# EAGLE design KramerMC_BS1k_ferryTALE2022_v1.0 (EAGLE 6.6.0)

## Sheet 1 of 2: BWS
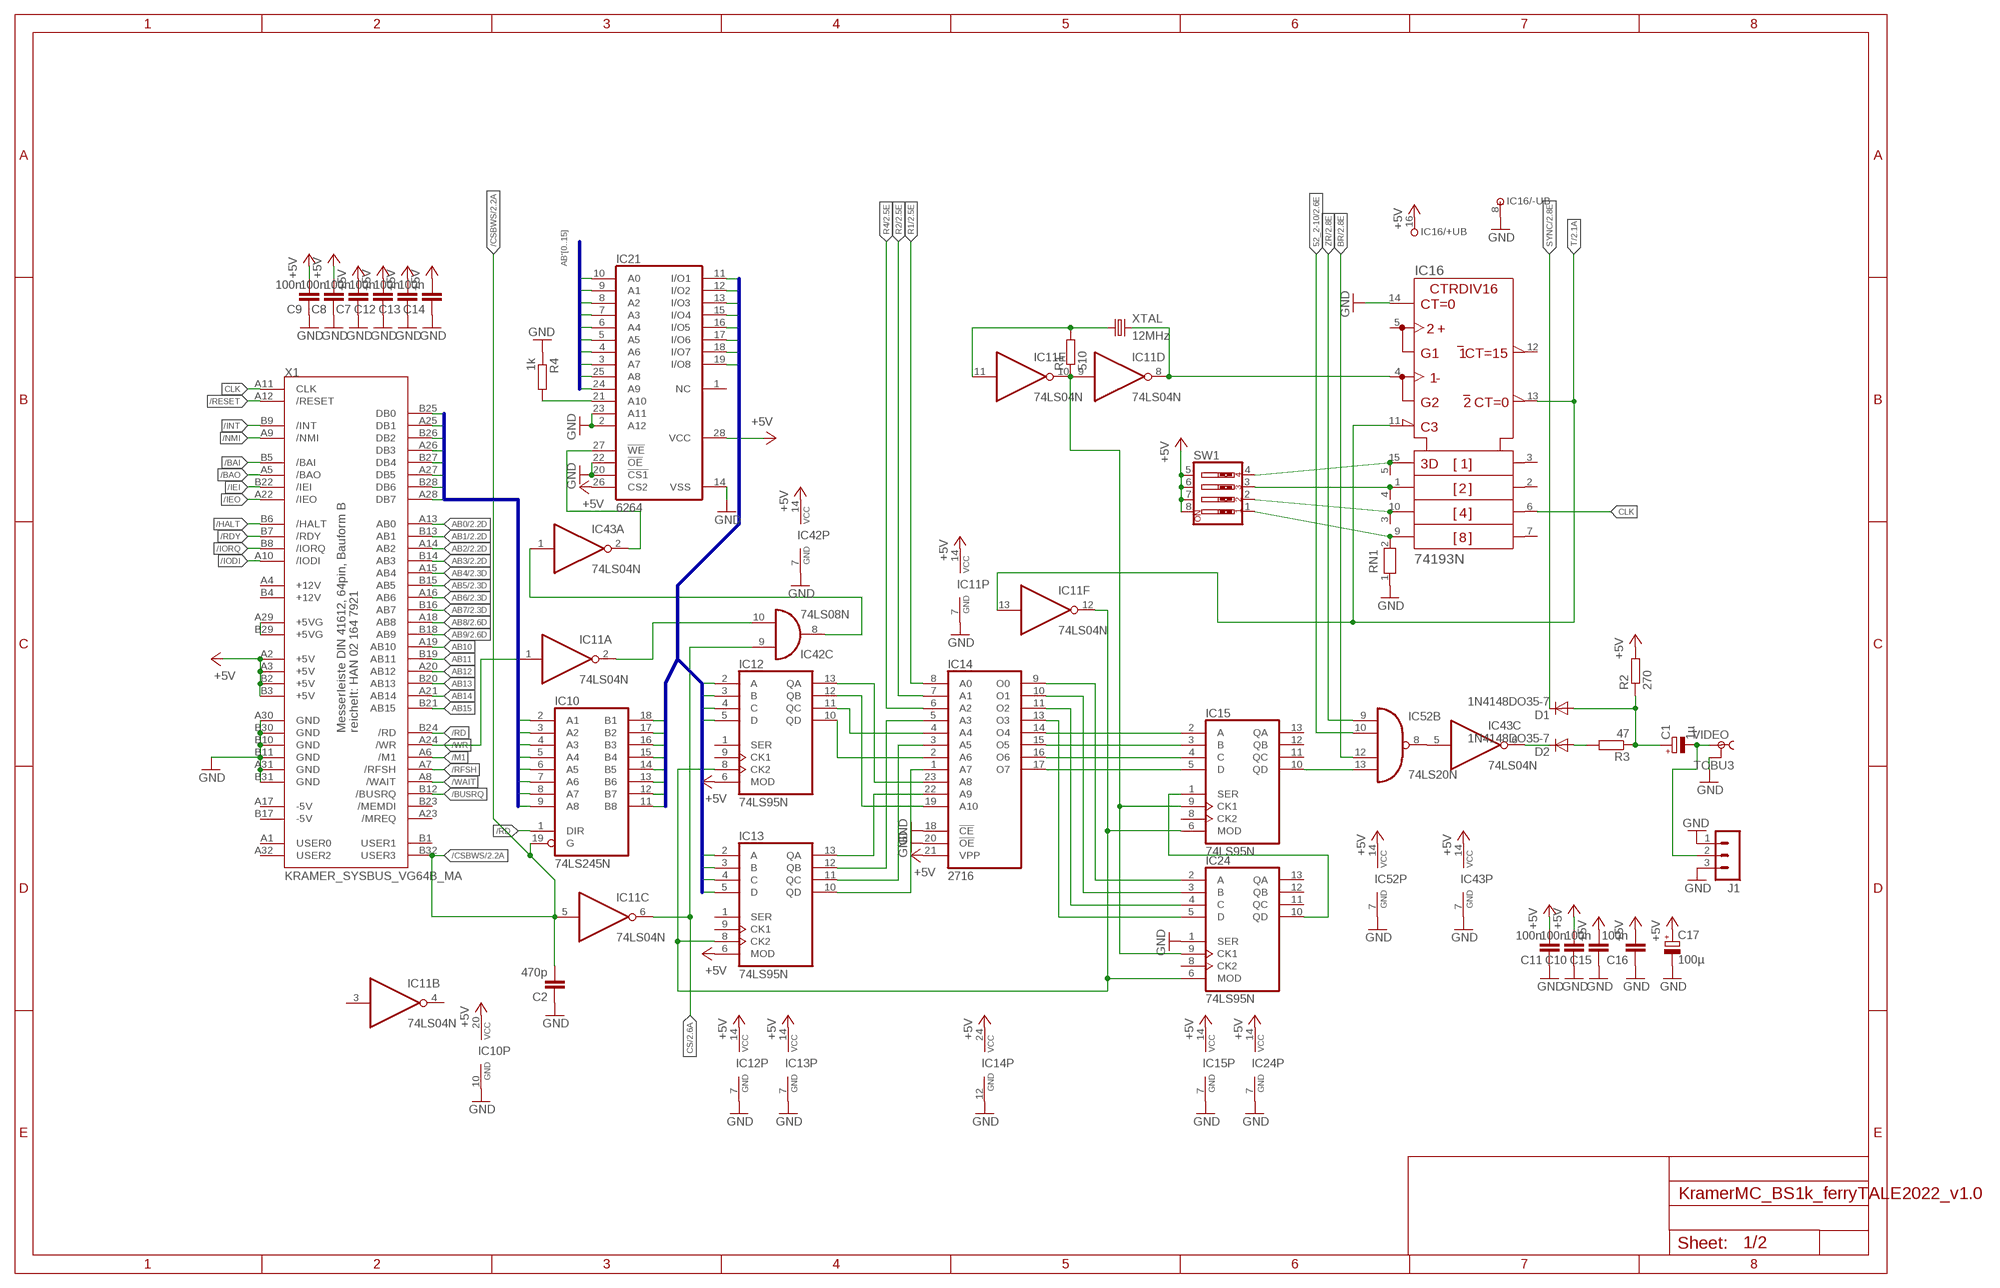
[diagram p0: schematic, sheet 1]

### Parts
C1  1µ  CPOL-EUE2.5-5  [E2,5-5]
C2  470p  C-EU050-024X044  [C050-024X044]
C7  100n  C-EU050-024X044  [C050-024X044]
C8  100n  C-EU050-024X044  [C050-024X044]
C9  100n  C-EU050-024X044  [C050-024X044]
C10  100n  C-EU050-024X044  [C050-024X044]
C11  100n  C-EU050-024X044  [C050-024X044]
C12  100n  C-EU050-024X044  [C050-024X044]
C13  100n  C-EU050-024X044  [C050-024X044]
C14  100n  C-EU050-024X044  [C050-024X044]
C15  100n  C-EU050-024X044  [C050-024X044]
C16  100n  C-EU050-024X044  [C050-024X044]
C17  100µ  CPOL-EUE2.5-7  [E2,5-7]
D1  1N4148DO35-7  [DO35-7]
D2  1N4148DO35-7  [DO35-7]
IC10  74LS245N  [DIL20]
IC11  74LS04N  [DIL14]
IC12  74LS95N  [DIL14]
IC13  74LS95N  [DIL14]
IC14  2716  [DIL24]
IC15  74LS95N  [DIL14]
IC16  74193N  [DIL16]
IC21  6264  6264A  [DIL28-6]
IC24  74LS95N  [DIL14]
IC42  74LS08N  [DIL14]
IC43  74LS04N  [DIL14]
IC52  74LS20N  [DIL14]
J1  MA03-1  [MA03-1]
R1  510  R-EU_0207/2V  [0207/2V]
R2  270  R-EU_0207/10  [0207/10]
R3  47  R-EU_0207/10  [0207/10]
R4  1k  R-EU_0207/10  [0207/10]
RN1  RN04  [RN-5]
SW1  SW_DIP-4  [EDG-04]
VIDEO  TOBU3  [TOBU3]
X1  KRAMER_SYSBUS_VG64B_MA  [MAB64]
XTAL  12MHz  CRYSTALHC49S  [HC49/S]

### Nets
52_2-10: IC52.10(B:I1) ; also sheet 2
+5V: C7.2 C8.2 C9.2 C10.2 C11.2 C12.2 C13.2 C14.2 C15.2 C16.2 C17.+ IC10.20(VCC) IC11.14(P:VCC) IC12.6(MOD) IC12.14(VCC) IC13.6(MOD) IC13.14(VCC) IC14.21(VPP) IC14.24(VCC) IC15.14(VCC) IC16.16(+UB) IC21.26(CS2) IC21.28(VCC) IC24.14(VCC) IC42.14(P:VCC) IC43.14(P:VCC) IC52.14(P:VCC) R2.2 SW1.5 SW1.6 SW1.7 SW1.8 X1.A2(+5V) X1.A3(+5V) X1.B2(+5V) X1.B3(+5V) ; also sheet 2
+5VG: X1.A29(+5VG) X1.B29(+5VG)
/BAI: X1.B5(/BAI)
/BAO: X1.A5(/BAO)
/BUSRQ: X1.B12(/BUSRQ)
/CSBWS: C2.2 IC10.19(G) IC11.5(C:I) X1.B32(USER3) ; also sheet 2
/HALT: X1.B6(/HALT)
/IEI: X1.B22(/IEI)
/IEO: X1.A22(/IEO)
/INT: X1.B9(/INT)
/IODI: X1.A10(/IODI)
/IORQ: X1.B8(/IORQ)
/M1: X1.A6(/M1)
/NMI: X1.A9(/NMI)
/RD: IC10.1(DIR) X1.B24(/RD)
/RDY: X1.B7(/RDY)
/RESET: X1.A12(/RESET)
/RFSH: X1.A7(/RFSH)
/WAIT: X1.A8(/WAIT)
/WR: IC11.1(A:I) X1.A24(/WR)
AB0: X1.A13(AB0) ; also sheet 2
AB1: X1.B13(AB1) ; also sheet 2
AB2: X1.A14(AB2) ; also sheet 2
AB3: X1.B14(AB3) ; also sheet 2
AB4: X1.A15(AB4) ; also sheet 2
AB5: X1.B15(AB5) ; also sheet 2
AB6: X1.A16(AB6) ; also sheet 2
AB7: X1.B16(AB7) ; also sheet 2
AB8: X1.A18(AB8) ; also sheet 2
AB9: X1.B18(AB9) ; also sheet 2
AB10: X1.A19(AB10)
AB11: X1.B19(AB11)
AB12: X1.A20(AB12)
AB13: X1.B20(AB13)
AB14: X1.A21(AB14)
AB15: X1.B21(AB15)
AB'0: IC21.10(A0) ; also sheet 2
AB'1: IC21.9(A1) ; also sheet 2
AB'2: IC21.8(A2) ; also sheet 2
AB'3: IC21.7(A3) ; also sheet 2
AB'4: IC21.6(A4) ; also sheet 2
AB'5: IC21.5(A5) ; also sheet 2
AB'6: IC21.4(A6) ; also sheet 2
AB'7: IC21.3(A7) ; also sheet 2
AB'8: IC21.25(A8) ; also sheet 2
AB'9: IC21.24(A9) ; also sheet 2
BR: IC52.12(B:I2) ; also sheet 2
CLK: IC16.6(QC) X1.A11(CLK)
CS: IC11.6(C:O) IC42.9(C:I0) ; also sheet 2
DB0: IC10.9(A8) X1.B25(DB0)
DB1: IC10.8(A7) X1.A25(DB1)
DB2: IC10.7(A6) X1.B26(DB2)
DB3: IC10.6(A5) X1.A26(DB3)
DB4: IC10.5(A4) X1.B27(DB4)
DB5: IC10.4(A3) X1.A27(DB5)
DB6: IC10.3(A2) X1.B28(DB6)
DB7: IC10.2(A1) X1.A28(DB7)
DB'0: IC10.11(B8) IC13.3(B) IC21.11(I/O1)
DB'1: IC10.12(B7) IC12.4(C) IC21.12(I/O2)
DB'2: IC10.13(B6) IC13.4(C) IC21.13(I/O3)
DB'3: IC10.14(B5) IC12.5(D) IC21.15(I/O4)
DB'4: IC10.15(B4) IC13.5(D) IC21.16(I/O5)
DB'5: IC10.16(B3) IC12.2(A) IC21.17(I/O6)
DB'6: IC10.17(B2) IC13.2(A) IC21.18(I/O7)
DB'7: IC10.18(B1) IC12.3(B) IC21.19(I/O8)
GND: C2.1 C7.1 C8.1 C9.1 C10.1 C11.1 C12.1 C13.1 C14.1 C15.1 C16.1 C17.- IC10.10(GND) IC11.7(P:GND) IC12.7(GND) IC13.7(GND) IC14.12(GND) IC14.18(!CE) IC14.20(!OE) IC15.7(GND) IC16.8(-UB) IC16.14(CLR) IC21.2(A12) IC21.14(VSS) IC21.20(!CS1) IC21.22(!OE) IC21.23(A11) IC24.1(SER) IC24.7(GND) IC42.7(P:GND) IC43.7(P:GND) IC52.7(P:GND) J1.1 J1.3 R4.1 RN1.1 VIDEO.2 VIDEO.2@1 VIDEO.2@2 X1.A30(GND) X1.A31(GND) X1.B10(GND) X1.B11(GND) X1.B30(GND) X1.B31(GND) ; also sheet 2
N$1: IC11.9(D:I) IC11.10(E:O) IC15.9(CK1) IC24.9(CK1) R1.1
N$2: IC11.11(E:I) R1.2 XTAL.1
N$3: IC11.8(D:O) IC16.4(DOWN) XTAL.2
N$4: IC12.13(QA) IC14.23(A8)
N$5: IC12.12(QB) IC14.19(A10)
N$6: IC12.11(QC) IC14.4(A4)
N$7: IC12.10(QD) IC14.2(A6)
N$8: IC13.13(QA) IC14.22(A9)
N$9: IC13.12(QB) IC14.5(A3)
N$10: IC13.11(QC) IC14.3(A5)
N$11: IC13.10(QD) IC14.1(A7)
N$12: IC14.17(O7) IC15.5(D)
N$13: IC11.2(A:O) IC42.10(C:I1)
N$14: IC42.8(C:O) IC43.1(A:I)
N$15: IC21.27(!WE) IC43.2(A:O)
N$16: IC14.16(O6) IC15.4(C)
N$17: IC14.15(O5) IC15.3(B)
N$18: C1.- J1.2 VIDEO.1
N$19: IC14.14(O4) IC15.2(A)
N$20: IC43.5(C:I) IC52.8(B:O)
N$21: IC14.13(O3) IC24.5(D)
N$22: IC14.11(O2) IC24.4(C)
N$23: IC14.10(O1) IC24.3(B)
N$24: IC14.9(O0) IC24.2(A)
N$25: IC15.1(SER) IC24.10(QD)
N$27: IC11.12(F:O) IC12.8(CK2) IC13.8(CK2) IC15.6(MOD) IC24.6(MOD)
N$28: C1.+ D1.A R2.1 R3.1
N$29: IC15.10(QD) IC52.13(B:I3)
N$30: IC16.15(A) RN1.5 SW1.4
N$31: D2.A R3.2
N$32: D2.C IC43.6(C:O)
N$50: IC16.1(B) RN1.4 SW1.3
N$58: IC16.10(C) RN1.3 SW1.2
N$59: IC16.9(D) RN1.2 SW1.1
N$60: IC21.21(A10) R4.2
R1: IC14.8(A0) ; also sheet 2
R2: IC14.7(A1) ; also sheet 2
R4: IC14.6(A2) ; also sheet 2
SYNC: D1.C ; also sheet 2
T: IC11.13(F:I) IC16.11(!LOAD) IC16.13(!BO) ; also sheet 2
ZR: IC52.9(B:I0) ; also sheet 2
Unconnected: IC11.3(B:I) IC11.4(B:O) IC12.1(SER) IC12.9(CK1) IC13.1(SER) IC13.9(CK1) IC15.8(CK2) IC15.11(QC) IC15.12(QB) IC15.13(QA) IC16.2(QB) IC16.3(QA) IC16.5(UP) IC16.7(QD) IC16.12(!CO) IC21.1(NC) IC24.8(CK2) IC24.11(QC) IC24.12(QB) IC24.13(QA) X1.A1(USER0) X1.A4(+12V) X1.A17(-5V) X1.A23(/MREQ) X1.A32(USER2) X1.B1(USER1) X1.B4(+12V) X1.B17(-5V) X1.B23(/MEMDI)

### Buses
DB[0..7]
DB'[0..7]
AB'[0..15]

### Notes on the sheet
- Messerleiste DIN 41612, 64pin, Bauform B
  reichelt: HAN 02 164 7921

## Sheet 2 of 2: Zeitbasis
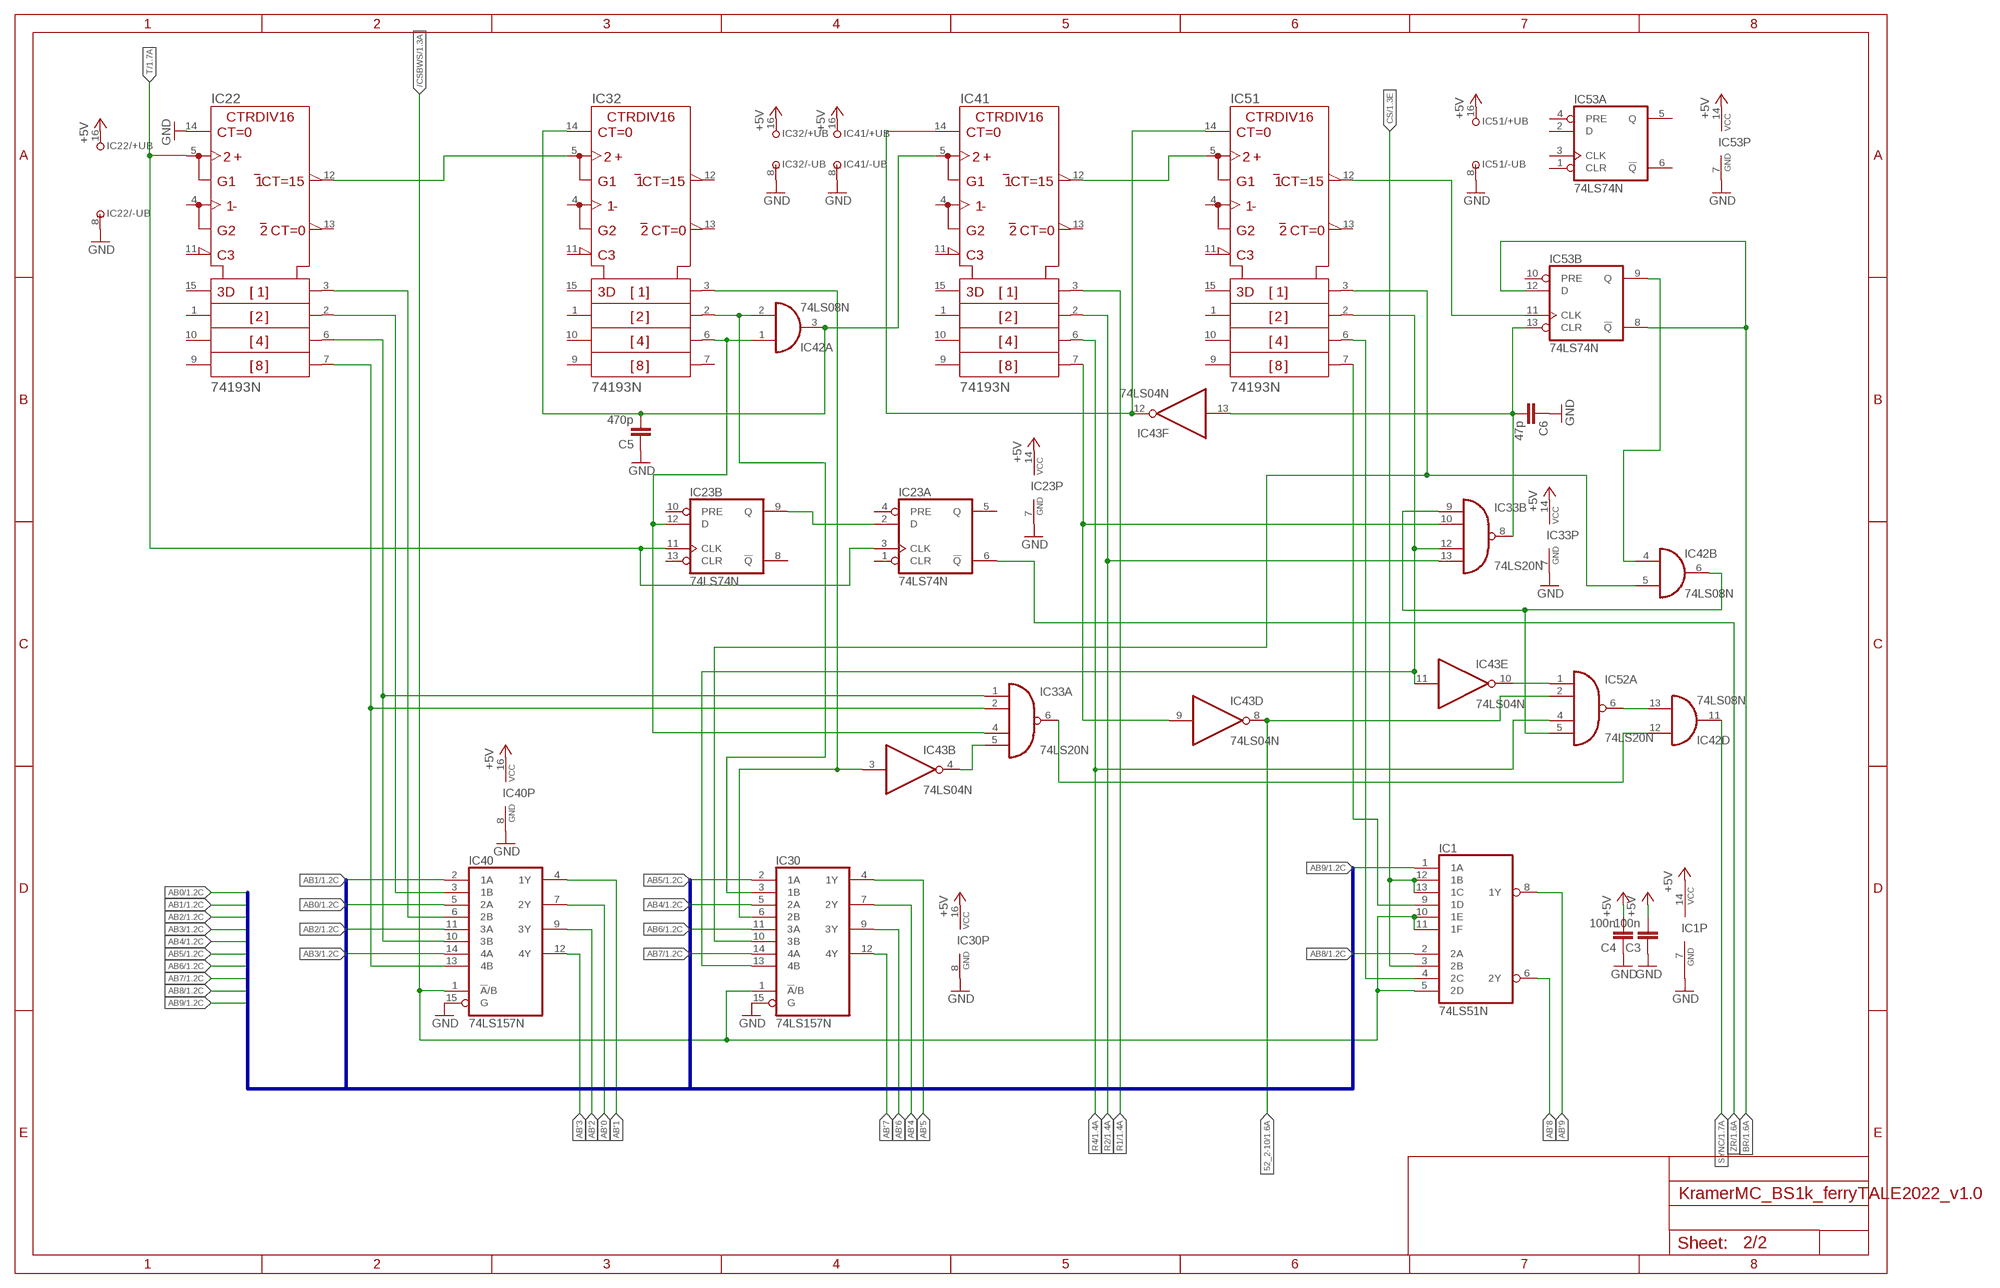
[diagram p1: schematic, sheet 2]

### Parts
C3  100n  C-EU050-024X044  [C050-024X044]
C4  100n  C-EU050-024X044  [C050-024X044]
C5  470p  C-EU050-024X044  [C050-024X044]
C6  47p  C-EU050-024X044  [C050-024X044]
IC1  74LS51N  [DIL14]
IC22  74193N  [DIL16]
IC23  74LS74N  [DIL14]
IC30  74LS157N  [DIL16]
IC32  74193N  [DIL16]
IC33  74LS20N  [DIL14]
IC40  74LS157N  [DIL16]
IC41  74193N  [DIL16]
IC51  74193N  [DIL16]
IC53  74LS74N  [DIL14]

### Nets
52_2-10: IC43.8(D:O) IC52.2(A:I1) ; also sheet 1
+5V: C3.2 C4.2 IC1.14(VCC) IC22.16(+UB) IC23.14(P:VCC) IC30.16(VCC) IC32.16(+UB) IC33.14(P:VCC) IC40.16(VCC) IC41.16(+UB) IC51.16(+UB) IC53.14(P:VCC) ; also sheet 1
/CSBWS: IC1.5(2D) IC1.10(1E) IC1.11(1F) IC30.1(!A!/B) IC40.1(!A!/B) ; also sheet 1
AB0: IC40.5(2A) ; also sheet 1
AB1: IC40.2(1A) ; also sheet 1
AB2: IC40.11(3A) ; also sheet 1
AB3: IC40.14(4A) ; also sheet 1
AB4: IC30.5(2A) ; also sheet 1
AB5: IC30.2(1A) ; also sheet 1
AB6: IC30.11(3A) ; also sheet 1
AB7: IC30.14(4A) ; also sheet 1
AB8: IC1.2(2A) ; also sheet 1
AB9: IC1.1(1A) ; also sheet 1
AB'0: IC40.7(2Y) ; also sheet 1
AB'1: IC40.4(1Y) ; also sheet 1
AB'2: IC40.9(3Y) ; also sheet 1
AB'3: IC40.12(4Y) ; also sheet 1
AB'4: IC30.7(2Y) ; also sheet 1
AB'5: IC30.4(1Y) ; also sheet 1
AB'6: IC30.9(3Y) ; also sheet 1
AB'7: IC30.12(4Y) ; also sheet 1
AB'8: IC1.6(2Y) ; also sheet 1
AB'9: IC1.8(1Y) ; also sheet 1
BR: IC53.8(B:!Q) IC53.12(B:D) ; also sheet 1
CS: IC1.3(2B) IC1.12(1B) IC1.13(1C) ; also sheet 1
GND: C3.1 C4.1 C5.1 C6.1 IC1.7(GND) IC22.8(-UB) IC22.14(CLR) IC23.7(P:GND) IC30.8(GND) IC30.15(G) IC32.8(-UB) IC33.7(P:GND) IC40.8(GND) IC40.15(G) IC41.8(-UB) IC51.8(-UB) IC53.7(P:GND) ; also sheet 1
N$26: IC22.3(QA) IC40.6(2B)
N$33: IC22.2(QB) IC40.3(1B)
N$34: IC22.6(QC) IC33.1(A:I0) IC40.10(3B)
N$35: IC22.7(QD) IC33.2(A:I1) IC40.13(4B)
N$36: IC22.12(!CO) IC32.5(UP)
N$37: C5.2 IC32.14(CLR) IC41.5(UP) IC42.3(A:O)
N$38: IC23.12(B:D) IC32.6(QC) IC33.4(A:I2) IC42.1(A:I0)
N$39: IC30.3(1B) IC32.2(QB) IC42.2(A:I1)
N$40: IC30.6(2B) IC32.3(QA) IC43.3(B:I)
N$41: IC33.5(A:I3) IC43.4(B:O)
N$42: IC23.2(A:D) IC23.9(B:Q)
N$43: IC41.12(!CO) IC51.5(UP)
N$44: IC41.14(CLR) IC43.12(F:O) IC51.14(CLR)
N$45: C6.2 IC33.8(B:O) IC43.13(F:I) IC53.13(B:CLR)
N$46: IC33.10(B:I1) IC41.7(QD) IC43.9(D:I)
N$47: IC33.9(B:I0) IC42.6(B:O) IC52.5(A:I3)
N$48: IC51.12(!CO) IC53.11(B:CLK)
N$49: IC30.10(3B) IC42.5(B:I1) IC51.3(QA)
N$51: IC30.13(4B) IC33.12(B:I2) IC43.11(E:I) IC51.2(QB)
N$52: IC42.4(B:I0) IC53.9(B:Q)
N$53: IC1.4(2C) IC51.6(QC)
N$54: IC1.9(1D) IC51.7(QD)
N$55: IC42.13(D:I1) IC52.6(A:O)
N$56: IC43.10(E:O) IC52.1(A:I0)
N$57: IC33.6(A:O) IC42.12(D:I0)
R1: IC41.3(QA) ; also sheet 1
R2: IC33.13(B:I3) IC41.2(QB) ; also sheet 1
R4: IC41.6(QC) IC52.4(A:I2) ; also sheet 1
SYNC: IC42.11(D:O) ; also sheet 1
T: IC22.5(UP) IC23.3(A:CLK) IC23.11(B:CLK) ; also sheet 1
ZR: IC23.6(A:!Q) ; also sheet 1
Unconnected: IC22.1(B) IC22.4(DOWN) IC22.9(D) IC22.10(C) IC22.11(!LOAD) IC22.13(!BO) IC22.15(A) IC23.1(A:CLR) IC23.4(A:PRE) IC23.5(A:Q) IC23.8(B:!Q) IC23.10(B:PRE) IC23.13(B:CLR) IC32.1(B) IC32.4(DOWN) IC32.7(QD) IC32.9(D) IC32.10(C) IC32.11(!LOAD) IC32.12(!CO) IC32.13(!BO) IC32.15(A) IC41.1(B) IC41.4(DOWN) IC41.9(D) IC41.10(C) IC41.11(!LOAD) IC41.13(!BO) IC41.15(A) IC51.1(B) IC51.4(DOWN) IC51.9(D) IC51.10(C) IC51.11(!LOAD) IC51.13(!BO) IC51.15(A) IC53.1(A:CLR) IC53.2(A:D) IC53.3(A:CLK) IC53.4(A:PRE) IC53.5(A:Q) IC53.6(A:!Q) IC53.10(B:PRE)

### Buses
AB[0..15]

## Library data of the parts
C1 C17 = rcl:CPOL-EU: POLARIZED CAPACITOR, European symbol
C2-C16 = rcl:C-EU: CAPACITOR, European symbol
D1 D2 = diode:1N4148: DIODE high speed (Philips)
IC1 = 74xx-us:74*51: AND-OR-INVERT gates/for S-type see 74S51 <DEVICE:74S51>
IC10 = 74xx-eu:74*245: Octal BUS TRANSCEIVER, 3-state
IC11 IC43 = 74xx-eu:74*04: Hex INVERTER
IC12 IC13 IC15 IC24 = 74xx-eu:74*95: 4-bit parallel access SHIFT REGISTER
IC14 = memory:2716: MEMORY
IC16 IC22 IC32 IC41 IC51 = 74ttl-din:74*193: Synchronus 4-bit up down COUNTER
IC21 = memory-hitachi:6264A: MEMORY; OC_FARNELL: 283605; OC_NEWARK: unknown
IC23 IC53 = 74xx-eu:74*74: Dual D type positive edge triggered FLIP FLOP, preset and clear
IC30 IC40 = 74xx-eu:74*157: Quadruple 2-line to 1-line data SELECTOR/MULTIPLEXER
IC33 IC52 = 74xx-eu:74*20: Dual 4-input NAND gate
IC42 = 74xx-eu:74*08: Quad 2-input AND gate
J1 = con-lstb:MA03-1: PIN HEADER; OC_FARNELL: unknown; OC_NEWARK: unknown
R1-R4 = rcl:R-EU_: RESISTOR, European symbol
RN1 = resistor-net:RN04: RESISTOR NETWORK; OC_FARNELL: unknown; OC_NEWARK: unknown
SW1 = special:SW_DIP-4: DIP SWITCH
VIDEO = ferry_con:TOBU3: Female Cinch CONNECTOR ( RCA Jack ); MF: FARNELL; MPN: TOBU 3; OC_FARNELL: 592791; OC_NEWARK: 06WX5914
X1 = ferry_Kramer_KC:KRAMER_SYSBUS: Kramer Kleincomputer System-Bus Buchse _MA für Module _FE für Busplatine
XTAL = crystal:CRYSTAL: CRYSTAL; OC_FARNELL: 1667008; OC_NEWARK: unknown

## Board
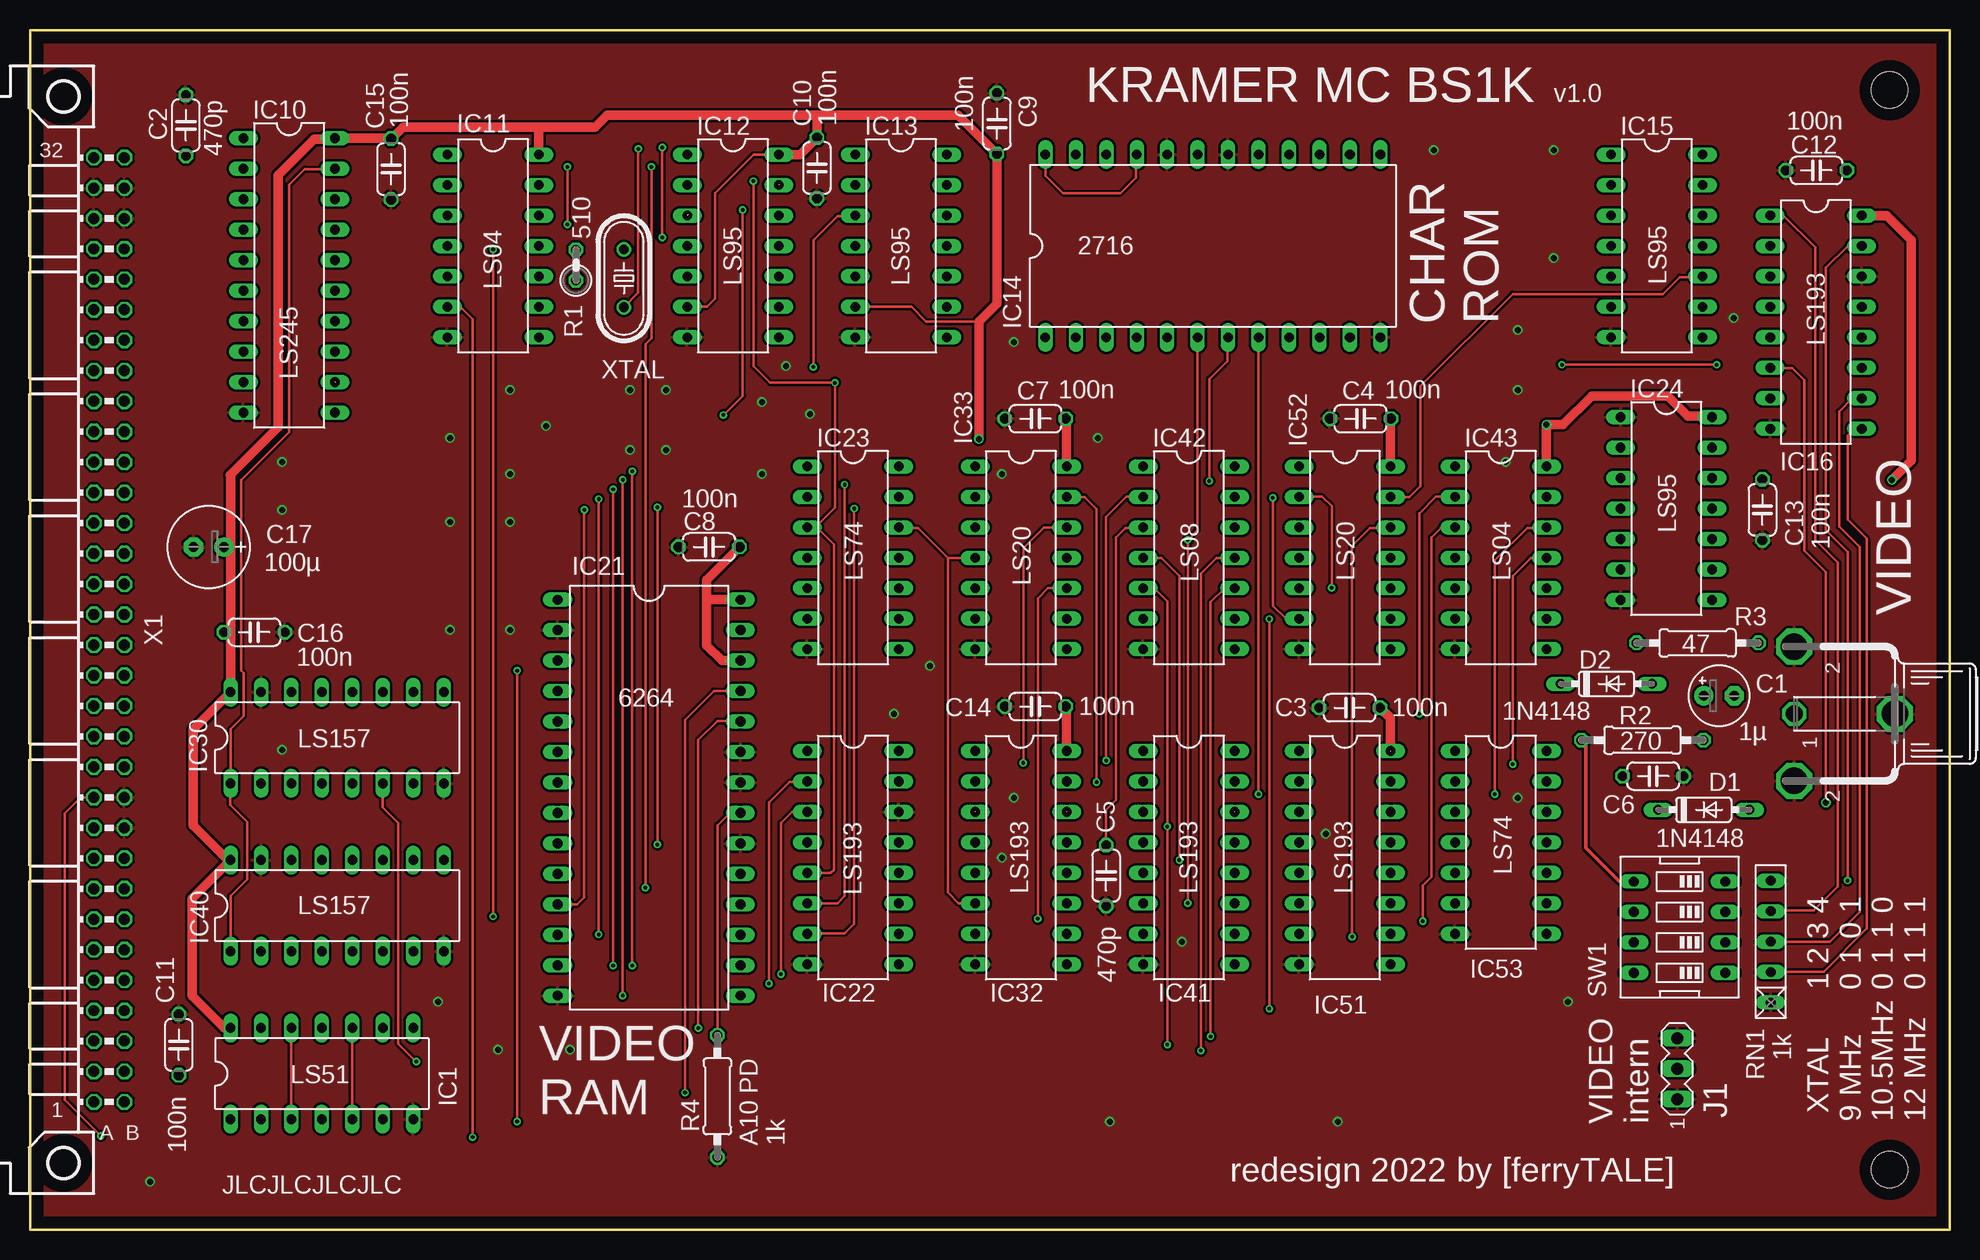
[diagram p2: board, top side]
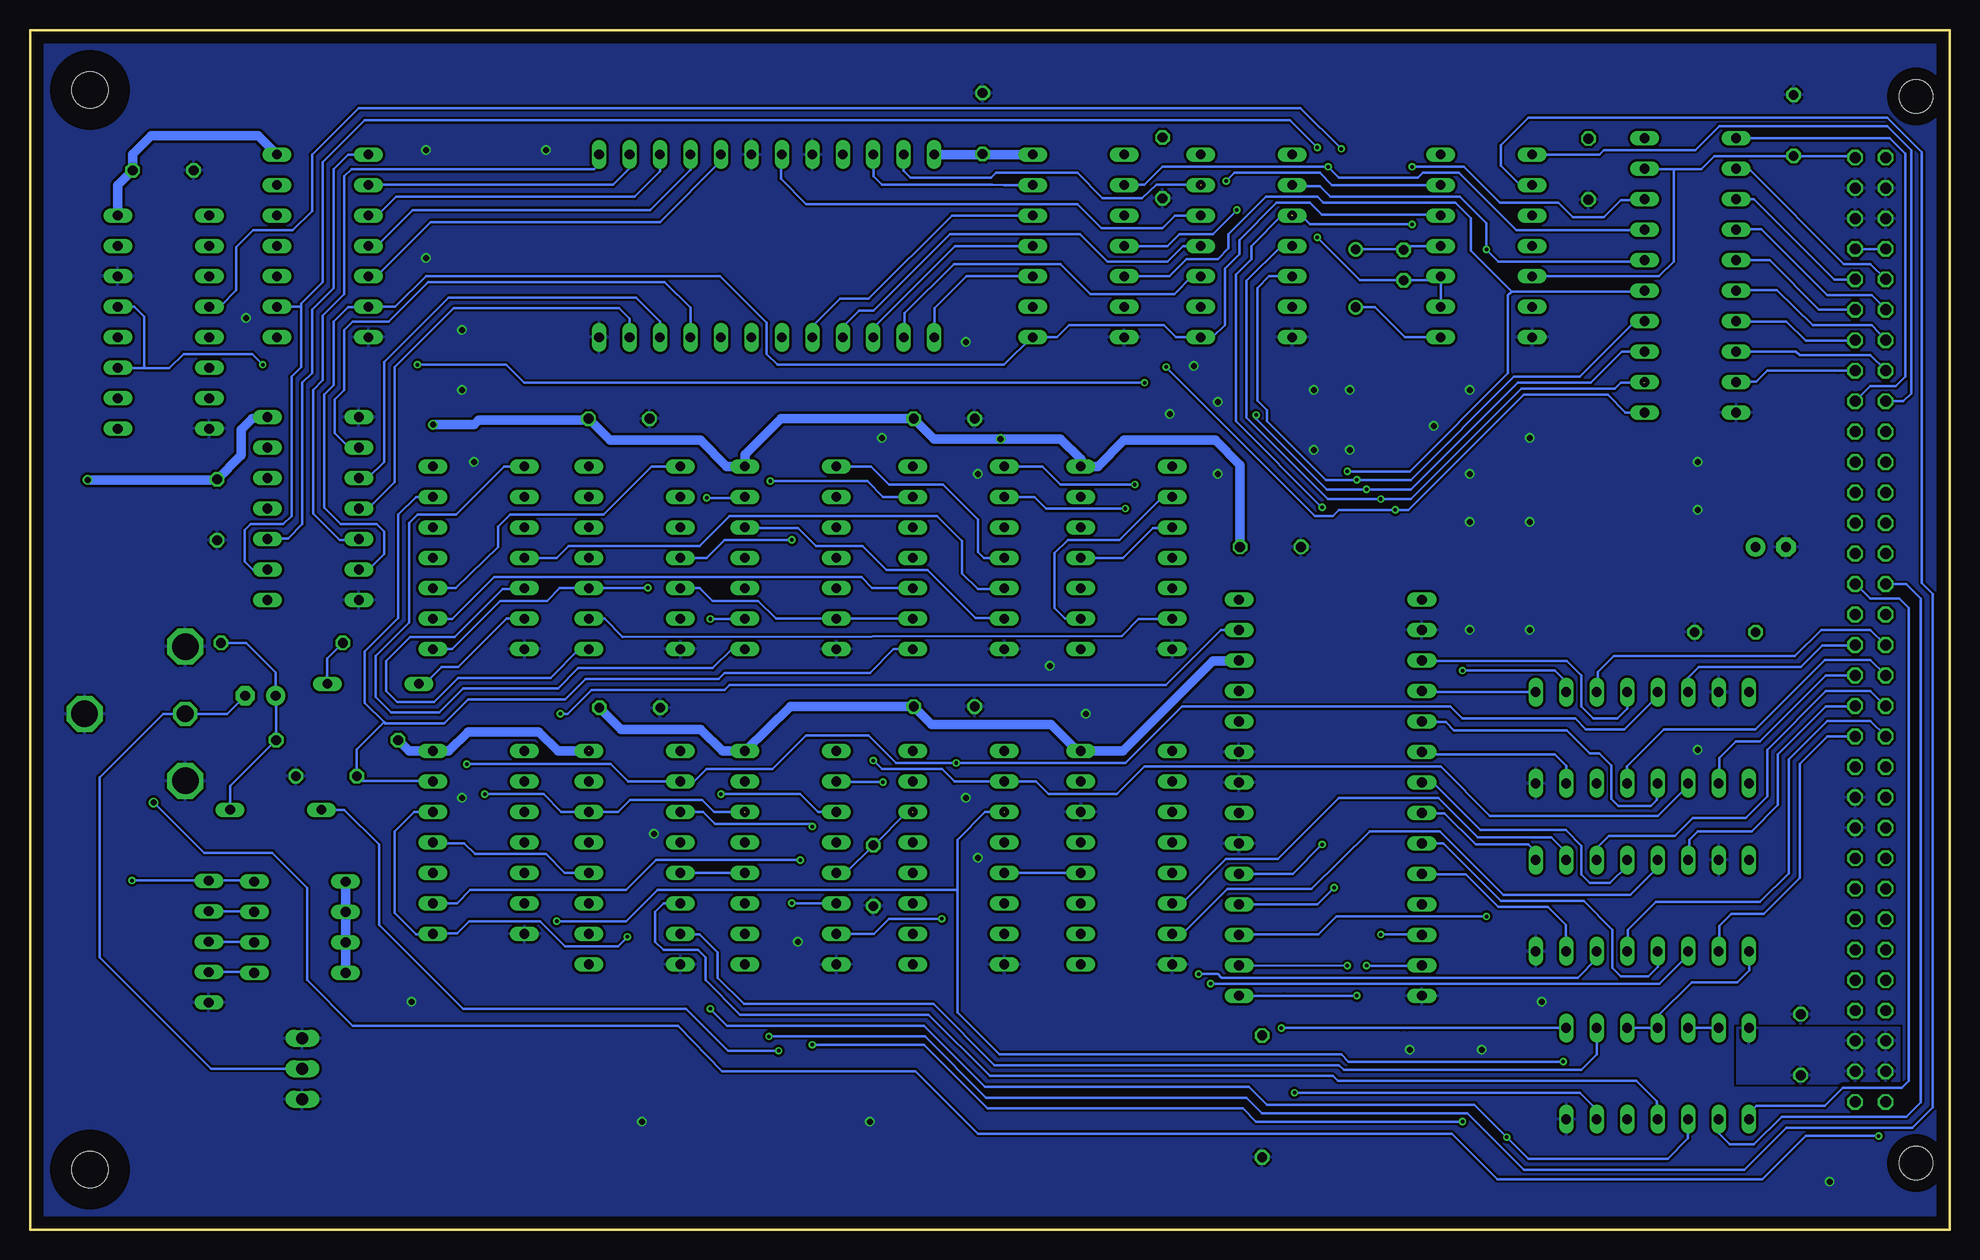
[diagram p3: board, bottom side, seen from below]

Size 160 x 100 mm. Coordinates in mm from the lower left corner, seen from the top.
Outline: 0,0 160,0 160,100 0,100 0,0
Copper layers (1*16): Top 0.035mm / dielectric 1.5mm / Bottom 0.035mm
Design rules "PCB-POOL Standard *": minimum track width 0.15mm, minimum drill 0.3mm, track to track 0.15mm, track to pad 0.15mm, pad to pad 0.15mm, via to via 0.15mm, smd to smd 0.15mm, copper to edge 1mm, drill to drill 0.5mm, minimum pad ring 0.2mm, minimum via ring 0.15mm, stop-mask expansion 0.075mm, vias tented up to drill 0mil, thermal gap 0.2mm
Holes 3 mm at 155,95 155,5
bRestrict: area 152,92 to 158,98; area 152,2 to 158,8

### Footprints (pad centres in the part's own frame; a part is rotated, then mirrored left to right if it is on the bottom)
E2,5-5 = drill 0.813 pad 1.6: + -1.27,0 | drill 0.813 pad 1.6 octagon: - 1.27,0
C050-024X044 = drill 0.813 octagon: 1 -2.54,0; 2 2.54,0
E2,5-7 = drill 0.813 pad 1.6: + -1.27,0 | drill 0.813 pad 1.6 octagon: - 1.27,0
DO35-7 = drill 0.813 long: A 3.81,0; C -3.81,0
DIL14 = drill 0.813 long: 1 -7.62,-3.81; 2 -5.08,-3.81; 3 -2.54,-3.81; 4 0,-3.81; 5 2.54,-3.81; 6 5.08,-3.81; 7 7.62,-3.81; 8 7.62,3.81; 9 5.08,3.81; 10 2.54,3.81; 11 0,3.81; 12 -2.54,3.81; 13 -5.08,3.81; 14 -7.62,3.81
DIL20 = drill 0.813 long: 1 -11.43,-3.81; 2 -8.89,-3.81; 3 -6.35,-3.81; 4 -3.81,-3.81; 5 -1.27,-3.81; 6 1.27,-3.81; 7 3.81,-3.81; 8 6.35,-3.81; 9 8.89,-3.81; 10 11.43,-3.81; 11 11.43,3.81; 12 8.89,3.81; 13 6.35,3.81; 14 3.81,3.81; 15 1.27,3.81; 16 -1.27,3.81; 17 -3.81,3.81; 18 -6.35,3.81; 19 -8.89,3.81; 20 -11.43,3.81
DIL24 = drill 0.813 long: 1 -13.97,-7.62; 2 -11.43,-7.62; 3 -8.89,-7.62; 4 -6.35,-7.62; 5 -3.81,-7.62; 6 -1.27,-7.62; 7 1.27,-7.62; 8 3.81,-7.62; 9 6.35,-7.62; 10 8.89,-7.62; 11 11.43,-7.62; 12 13.97,-7.62; 13 13.97,7.62; 14 11.43,7.62; 15 8.89,7.62; 16 6.35,7.62; 17 3.81,7.62; 18 1.27,7.62; 19 -1.27,7.62; 20 -3.81,7.62; 21 -6.35,7.62; 22 -8.89,7.62; 23 -11.43,7.62; 24 -13.97,7.62
DIL16 = drill 0.813 long: 1 -8.89,-3.81; 2 -6.35,-3.81; 3 -3.81,-3.81; 4 -1.27,-3.81; 5 1.27,-3.81; 6 3.81,-3.81; 7 6.35,-3.81; 8 8.89,-3.81; 9 8.89,3.81; 10 6.35,3.81; 11 3.81,3.81; 12 1.27,3.81; 13 -1.27,3.81; 14 -3.81,3.81; 15 -6.35,3.81; 16 -8.89,3.81
DIL28-6 = drill 0.813 long: 1 -16.51,-7.62; 2 -13.97,-7.62; 3 -11.43,-7.62; 4 -8.89,-7.62; 5 -6.35,-7.62; 6 -3.81,-7.62; 7 -1.27,-7.62; 8 1.27,-7.62; 9 3.81,-7.62; 10 6.35,-7.62; 11 8.89,-7.62; 12 11.43,-7.62; 13 13.97,-7.62; 14 16.51,-7.62; 15 16.51,7.62; 16 13.97,7.62; 17 11.43,7.62; 18 8.89,7.62; 19 6.35,7.62; 20 3.81,7.62; 21 1.27,7.62; 22 -1.27,7.62; 23 -3.81,7.62; 24 -6.35,7.62; 25 -8.89,7.62; 26 -11.43,7.62; 27 -13.97,7.62; 28 -16.51,7.62
MA03-1 = drill 1.016 long: 1 -2.54,0; 2 0,0; 3 2.54,0
0207/2V = drill 0.813 octagon: 1 -1.27,0; 2 1.27,0
0207/10 = drill 0.813 octagon: 1 -5.08,0; 2 5.08,0
RN-5 = drill 0.813 long: 1 -5.08,0; 2 -2.54,0; 3 0,0; 4 2.54,0; 5 5.08,0
EDG-04 = drill 0.813 long: 1 -3.81,-3.81; 2 -1.27,-3.81; 3 1.27,-3.81; 4 3.81,-3.81; 5 3.81,3.81; 6 1.27,3.81; 7 -1.27,3.81; 8 -3.81,3.81
TOBU3 = drill 1.397 pad 2 octagon: 1 0,-2.54 | drill 2.21 pad 3 octagon: 2 5.588,-2.54; 2@1 -5.588,-2.54; 2@2 0,5.85
MAB64 = drill 0.914 octagon: A1 39.37,-1.27; A2 36.83,-1.27; A3 34.29,-1.27; A4 31.75,-1.27; A5 29.21,-1.27; A6 26.67,-1.27; A7 24.13,-1.27; A8 21.59,-1.27; A9 19.05,-1.27; A10 16.51,-1.27; A11 13.97,-1.27; A12 11.43,-1.27; A13 8.89,-1.27; A14 6.35,-1.27; A15 3.81,-1.27; A16 1.27,-1.27; A17 -1.27,-1.27; A18 -3.81,-1.27; A19 -6.35,-1.27; A20 -8.89,-1.27; A21 -11.43,-1.27; A22 -13.97,-1.27; A23 -16.51,-1.27; A24 -19.05,-1.27; A25 -21.59,-1.27; A26 -24.13,-1.27; A27 -26.67,-1.27; A28 -29.21,-1.27; A29 -31.75,-1.27; A30 -34.29,-1.27; A31 -36.83,-1.27; A32 -39.37,-1.27; B1 39.37,1.27; B2 36.83,1.27; B3 34.29,1.27; B4 31.75,1.27; B5 29.21,1.27; B6 26.67,1.27; B7 24.13,1.27; B8 21.59,1.27; B9 19.05,1.27; B10 16.51,1.27; B11 13.97,1.27; B12 11.43,1.27; B13 8.89,1.27; B14 6.35,1.27; B15 3.81,1.27; B16 1.27,1.27; B17 -1.27,1.27; B18 -3.81,1.27; B19 -6.35,1.27; B20 -8.89,1.27; B21 -11.43,1.27; B22 -13.97,1.27; B23 -16.51,1.27; B24 -19.05,1.27; B25 -21.59,1.27; B26 -24.13,1.27; B27 -26.67,1.27; B28 -29.21,1.27; B29 -31.75,1.27; B30 -34.29,1.27; B31 -36.83,1.27; B32 -39.37,1.27 | hole 2.794: 44.45,-3.81; -44.45,-3.81
HC49/S = drill 0.813: 1 -2.413,0; 2 2.413,0

### Placement (x,y rotation side)
C1  140.8,44.5 0 top
C2  12.99,92.05 270 top
C3  110,43.5 0 top
C4  110.9,67.6 0 top
C5  89.7,29.5 90 top
C6  135.3,37.8 180 top
C7  83.8,67.6 0 top
C8  56.6,56.9 0 top
C9  80.6,92.2 270 top
C10  65.6,88.5 90 top
C11  12.4,15.4 270 top
C12  148.9,88.3 0 top
C13  144.4,60 90 top
C14  83.8,43.6 0 top
C15  30.1,88.4 90 top
C16  18.7,49.8 180 top
C17  14.9,56.9 180 top
D1  139.51,35 0 top
D2  131.4,45.5 0 top
IC1  24.33,13 0 top
IC10  21.6,79.54 270 top
IC11  38.6,82 270 top
IC12  58.6,82 270 top
IC13  72.6,82 270 top
IC14  98.6,82 0 top
IC15  135.6,82 270 top
IC16  148.87,75.65 270 top
IC21  51.6,36 270 top
IC22  68.6,31 270 top
IC23  68.6,56 270 top
IC24  136.4,60.1 270 top
IC30  25.6,41 0 top
IC32  82.6,31 270 top
IC33  82.6,56 270 top
IC40  25.6,27 0 top
IC41  96.6,31 270 top
IC42  96.6,56 270 top
IC43  122.6,56 270 top
IC51  109.6,31 270 top
IC52  109.6,56 270 top
IC53  122.6,32.27 270 top
J1  137.3,13.4 90 top
R1  45.5,80.4 90 top
R2  134.4,40.8 180 top
R3  139,48.9 180 top
R4  57.3,11.1 90 top
RN1  145.1,24 90 top
SW1  137.5,25.2 90 top
VIDEO  149.6,43 270 top
X1  6.6,50 270 top
XTAL  49.5,79.3 270 top

### Tracks (layer width: path | path; a pad name or v marks a point on that pad's centre or on a via)
52_2-10  (via drill 0.3)
  Top 0.2: v108.5,53.5 108.5,60.3 107.7,61.1 105.81,61.1 IC52.2
  Bottom 0.2: IC43.8 126.39,48.4 124.8,48.4 120.8,52.4 116.9,52.4 115.84,53.46 IC52.10 113.24,53.46 113.1,53.5 v108.5,53.5
+5V  (via drill 0.5)  (1 unrouted)
  Top 0.2: IC13.6 73.48,76.92 74.7,75.7 79.1,75.7 | IC40.16 16.49,30.81 | IC14.24 84.63,87.87 86.1,86.4 90.9,86.4 92.2,87.7 92.2,89.57 IC14.21 | IC12.6 56.42,76.92 57.1,77.6 57.1,86.4 60.3,89.6 62.39,89.6 IC12.14
  Top 0.3: SW1.5 132.49,29.01 129.7,31.8 129.7,40.42 R2.2
  Top 0.8: v79.1,65.9 79.1,75.7 80.6,77.2 C9.2 77.36,92.9 65.6,92.9 | IC1.14 16.19,16.81 13.5,19.5 13.5,27.6 IC40.16 | 16.49,30.81 13.6,33.7 13.6,41.7 IC30.16 16.71,50 | 16.71,50 16.71,57 | 16.71,57 16.71,62.89 16.7,62.9 20.7,66.9 20.7,87.9 23.7,90.9 25.34,90.9 IC10.20 30.07,90.97 C15.2 30.14,90.94 31.1,91.9 42.1,91.9 | IC52.14 113.41,66.83 C4.2 | IC33.14 86.41,67.53 C7.2 | 42.1,91.9 47.1,91.9 48.1,92.9 65.6,92.9 | IC11.14 42.41,91.59 42.1,91.9 | IC12.14 64.18,89.62 C10.2 65.6,92.9 | IC43.14 v126.41,67.09 | v126.41,67.09 v126.4,67.1 | v126.41,67.09 127.79,67.09 130.2,69.5 136.5,69.5 138.2,67.8 140.13,67.8 IC24.14 | IC16.16 154.76,84.54 156.8,82.5 156.8,64.1 v155.2,62.5 | IC21.26 57.67,47.43 56.4,48.7 56.4,52.4 | 56.4,52.4 56.4,54.16 C8.2 | IC21.28 56.51,52.51 56.4,52.4 | C16.2 16.51,49.8 16.71,50 | C17.+ 16.61,56.9 16.71,57 | IC51.16 113.41,42.63 C3.2 | IC32.16 86.41,43.53 C14.2
  Bottom 0.2: 80.58,89.62 C9.2 80.62,89.62 | 113.34,67.5 C4.2 | 113.41,67.39 113.3,67.5 | IC22.16 72.69,39.89 | 59.25,47.4 IC21.26 | v126.41,67.09 v126.4,67.1 | IC53.14 | 65.09,65.79 65.1,65.8
  Bottom 0.8: 113.3,67.5 113.34,67.5 122.6,67.5 123,67.1 v126.4,67.1 | IC24.14 141.48,67.62 142.4,66.7 142.4,64.56 142.48,64.46 C13.2 144.44,62.5 v155.2,62.5 | 72.69,39.89 74.9,42.1 84.84,42.1 C14.2 96.6,43.6 IC41.16 102.29,39.89 104.1,41.7 110.74,41.7 C3.2 | C4.2 111.64,65.8 104.1,65.8 101.92,63.62 IC42.14 100.41,64.59 97.4,67.6 C7.2 84.64,65.9 v79.1,65.9 74.1,65.9 72.41,64.21 IC23.14 70.98,63.62 68.8,65.8 65.1,65.8 61.2,65.8 59.14,63.74 C8.2 | IC22.16 68.91,39.89 61.4,47.4 59.25,47.4 | IC53.14 125.1,39.9 123.5,41.5 117.6,41.5 116,39.9 IC51.16 | IC53.14 128.41,39.89 R2.2 | IC16.16 152.68,87.06 C12.2 151.44,89.66 149.9,91.2 140.99,91.2 IC15.14 | IC13.14 80.56,89.62 C9.2 80.64,89.62 IC14.24 | SW1.8 SW1.7 SW1.6 SW1.5
  pour Bottom (isolate 0.35, rank 5): 4.2,12.2 4.2,16.8 17.7,16.8 17.7,12.2
+5VG
  Bottom 0.2: X1.A29 X1.B29
/CSBWS
  Top 0.2: IC40.1 16.71,27.81 18.1,29.2 18.1,34 16.7,35.4 IC30.1 16.71,41.71 17.8,42.8 17.8,46.4 17.6,46.6 17.6,62.5 21.6,66.5 21.6,87.1 22.9,88.4 25.38,88.4 IC10.19 | IC1.5 IC1.10
  Bottom 0.2: IC40.1 16.7,21.6 17.7,20.6 21.5,20.6 24.3,17.8 24.3,16.91 IC1.11 IC1.10 | X1.B32 7.97,89.37 8.1,89.5 12.7,89.5 | 12.7,89.5 19.6,89.5 20.7,88.4 23,88.4 | 23,88.4 25.38,88.4 IC10.19 | C2.2 12.71,89.51 12.7,89.5 | IC11.5 24.24,79.46 23,80.7 23,88.4
/RD
  Bottom 0.2: IC10.1 4.97,90.97 3.7,89.7 3.7,71.1 4.5,70.3 6.62,70.3 X1.B24
/WR
  Bottom 0.2: X1.A24 3.85,69.05 3.2,69.7 3.2,90 5.2,92 19.2,92 21.2,90 28.8,90 29.2,89.6 34.77,89.6 IC11.1
AB0
  Bottom 0.2: X1.A13 5.33,41.13 6.6,42.4 9.2,42.4 10.2,42.4 13.4,39.2 13.4,29.7 15.8,27.3 24.5,27.3 26.8,25 26.8,23.26 IC40.5
AB1
  Bottom 0.2: X1.B13 9.49,41.11 9.5,41.1 10.2,41.1 12.5,38.8 12.5,29.3 15.5,26.3 18.2,26.3 19.2,25.3 19.2,23.24 IC40.2
AB2
  Bottom 0.2: X1.A14 5.35,43.65 6.6,44.9 9.3,44.9 10.3,44.9 15.2,40 15.2,36.1 17,34.3 21.4,34.3 22.9,32.8 28.4,32.8 29.4,31.8 IC40.11
AB3
  Bottom 0.2: X1.B14 7.95,43.65 8,43.6 10.3,43.6 14.3,39.6 14.3,35.4 16.5,33.2 21,33.2 21.7,32.5 21.7,30.9 IC40.14
AB4
  Bottom 0.2: X1.A15 5.33,46.23 6.6,47.5 9,47.5 10.4,47.5 16.2,41.7 23.8,41.7 26.9,38.6 26.9,37.22 IC30.5
AB5
  Bottom 0.2: X1.B15 8.61,46.19 8.7,46.2 10.3,46.2 15.8,40.7 17.8,40.7 19.2,39.3 19.2,37.24 IC30.2
AB6
  Bottom 0.2: X1.A16 6.6,50 9,50 10.7,50 12.9,47.8 28,47.8 29.3,46.5 29.3,44.92 IC30.11
AB7
  Bottom 0.2: X1.B16 7.9,48.7 10.6,48.7 12.4,46.9 20.9,46.9 21.8,46 IC30.14
AB8
  Bottom 0.2: X1.A18 3.61,53.81 2.4,52.6 2.4,10.6 3.6,9.4 14,9.4 16.3,7.1 18.3,7.1 19.2,8 19.2,9.07 IC1.2
AB9
  Bottom 0.2: X1.B18 7.81,53.81 6.6,52.6 4.2,52.6 3.4,51.8 3.4,12.4 4,11.8 8.9,11.8 10.4,10.3 16.1,10.3 16.7,9.7 16.7,9.17 IC1.1
AB'0
  Bottom 0.2: IC40.7 31.95,23.65 32,23.6 32,25.4 33.5,26.9 37.6,26.9 40.3,29.6 43.93,29.6 IC21.10
AB'1
  Bottom 0.2: IC21.9 42.19,32.19 37.4,27.4 30.5,27.4 28.1,25 28.1,21.8 27.4,21.1 25.1,21.1 24.3,21.9 24.3,23.16 IC40.4
AB'2
  Bottom 0.2: IC21.8 43.95,34.7 42.1,34.7 39.5,32.1 35.1,32.1 34.5,31.5 IC40.9
AB'3
  Bottom 0.2: IC40.12 26.87,30.33 28.3,28.9 30,28.9 30.7,29.6 30.7,32 32,33.3 39.1,33.3 43,37.2 43.91,37.2 IC21.7
AB'4
  Bottom 0.2: IC30.7 31.95,38.65 32.9,39.6 42.9,39.6 43.1,39.8 IC21.6
AB'5
  Bottom 0.2: IC30.4 24.4,37.12 24.4,35.8 24.9,35.3 27.6,35.3 28.2,35.9 28.2,38.7 29.2,39.7 30,39.7 31.9,41.6 41.3,41.6 42,42.3 43.93,42.3 IC21.5
AB'6
  Bottom 0.2: IC30.9 43.9,44.81 IC21.4
AB'7
  Bottom 0.2: IC30.12 26.87,43.43 27.7,42.6 29.7,42.6 30.7,43.6 30.7,46.2 31.9,47.4 43.95,47.4 IC21.3
AB'8  (via drill 0.3)
  Top 0.2: v54.6,11.4 54.6,42.5 57,44.9 IC21.25
  Bottom 0.2: IC1.6 29.4,10 30.8,11.4 v54.6,11.4
AB'9  (via drill 0.3)
  Top 0.2: v55.7,16.8 55.7,40.8 57.3,42.4 59.17,42.4 IC21.24
  Bottom 0.2: IC1.8 45.21,16.81 45.7,16.8 v55.7,16.8
BR  (via drill 0.3)
  Top 0.2: v110.2,24.4 110.2,57 111.7,58.5 113.37,58.5 IC52.12
  Bottom 0.2: IC53.8 126.46,24.6 127.8,24.6 129.6,26.4 129.6,33.2 128,34.8 IC53.12 | IC53.8 | v110.2,24.4 111,23.6 115.4,23.6 117.5,25.7 123.4,25.7 124.4,24.7 126.36,24.7 IC53.8
CLK  (via drill 0.3, 0.5)
  Top 0.2: X1.A11 4.23,36.03 2.9,34.7 2.9,10.8 v5.9,7.8 | IC16.6 145.02,71.8 146.9,71.8 147.9,70.8 147.9,56.6 149.7,54.8 v149.7,35.6
  Bottom 0.2: v5.9,7.8 12,7.8 15.6,4.2 37.7,4.2 41.5,8 81,8 86.2,13.2 102.3,13.2 106,17 133.1,17 136.9,20.8 136.9,28.5 139.8,31.4 145.5,31.4 v149.7,35.6
CS  (via drill 0.3)
  Top 0.2: v36.9,7.7 36.9,75.9 35.9,76.9 34.81,76.9 IC11.6 | v103.3,18.4 v103.3,50.9 | IC1.3 IC1.12
  Bottom 0.2: IC42.9 100.48,50.92 100.5,50.9 v103.3,50.9 | IC1.13 IC1.12 | IC1.3 21.8,9.15 21.8,7.6 23.5,5.9 35.1,5.9 v36.9,7.7 39.6,10.4 56.9,10.4 58.4,11.9 80.4,11.9 85.5,17 101.9,17 v103.3,18.4
DB0
  Bottom 0.2: X1.B25 9.29,71.59 9.3,71.6 15.2,71.6 16.1,70.7 17.74,70.7 IC10.9
DB1
  Bottom 0.2: X1.A25 5.33,71.63 6.6,72.9 12.5,72.9 12.8,73.2 IC10.8
DB2
  Bottom 0.2: X1.B26 8.07,74.13 8.1,74.1 12,74.1 13.6,75.7 17.76,75.7 IC10.7
DB3
  Bottom 0.2: X1.A26 6.5,75.4 11.4,75.4 14.4,78.3 17.76,78.3 IC10.6
DB4
  Bottom 0.2: X1.B27 7.97,76.67 8,76.7 10.9,76.7 15,80.8 IC10.5
DB5
  Bottom 0.2: X1.A27 5.33,76.73 6.5,77.9 10.2,77.9 15.7,83.4 17.74,83.4 IC10.4
DB6
  Bottom 0.2: X1.B28 8.09,79.21 8.2,79.2 9.6,79.2 16.3,85.9 IC10.3
DB7
  Bottom 0.2: X1.A28 5.33,79.23 6.6,80.5 8.8,80.5 16.7,88.4 17.76,88.4 IC10.2
DB'0  (via drill 0.3)
  Top 0.2: IC21.11 45.61,27.11 46.2,27.7 v46.2,60 | v65.3,71.9 65.3,82.5 67.3,84.5 68.75,84.5 IC13.3
  Bottom 0.2: IC10.11 27.01,68.11 28.5,69.6 35.49,69.61 45.1,60 v46.2,60 50.9,60 51.4,59.5 52.9,59.5 v65.3,71.9
DB'1  (via drill 0.3)  (1 unrouted)
  Top 0.2: v47.4,60.9 v47.4,24.6
  Bottom 0.2: v47.4,24.6 44.01,24.6 IC21.12 | 25.46,70.6 27.4,70.6 27.9,70.1 35.7,70.1 44.9,60.9 v47.4,60.9 51.8,60.9 58.6,67.7 58.6,79.1 55.7,82 IC12.4
DB'2  (via drill 0.3)
  Top 0.2: v57.8,67.9 59.4,69.5 v59.4,85 | v48.6,22 v48.6,61.7
  Bottom 0.2: v48.6,22 44.01,22 IC21.13 | IC13.4 65.2,82 64.2,83 61.4,83 v59.4,85 | IC10.13 27.31,73.19 29.9,70.6 36,70.6 44.9,61.7 v48.6,61.7 51.9,61.7 57.8,67.6 v57.8,67.9
DB'3  (via drill 0.3)
  Top 0.2: v49.4,19.5 v49.4,62.5
  Bottom 0.2: 54.83,79.5 IC12.5 56.74,79.46 57.7,78.5 57.7,69.1 56.9,68.3 56.9,67.4 52,62.5 v49.4,62.5 44.9,62.5 36.3,71.1 30.8,71.1 26.17,75.73 IC10.14 | IC21.15 57.51,19.49 55.5,19.5 v49.4,19.5
DB'4  (via drill 0.3)
  Top 0.2: v50.2,63.2 v50.2,22
  Bottom 0.2: IC13.5 65.04,79.46 63.6,80.9 61,80.9 60.1,81.8 60.1,83 57,86.1 52.7,86.1 52.2,85.6 41.2,85.6 39.9,84.3 39.9,81.6 36.5,78.2 | IC21.16 59.17,22.03 v50.2,22 | v50.2,63.2 45,63.2 36.8,71.4 36.8,77.9 36.5,78.2 | IC10.15 26.53,78.27 26.6,78.2 36.5,78.2
DB'5  (via drill 0.3)
  Top 0.2: v38.6,81.7 v38.6,26.1
  Bottom 0.2: IC12.2 54.71,87 52.5,87 51.6,86.1 40.8,86.1 38.6,83.9 v38.6,81.7 37.6,80.7 25.52,80.7 IC10.16 | 38.99,26.09 v38.6,26.1 51.1,26.1 52.6,24.6 59.19,24.6 IC21.17
DB'6  (via drill 0.3)
  Top 0.2: v51.3,28.5 51.3,73.8 51.8,74.3 v51.8,88.6
  Bottom 0.2: IC21.18 52.69,27.11 v51.3,28.5 | IC13.2 68.77,87.1 67.1,87.1 65.6,88.6 v51.8,88.6 50.9,87.7 44.3,87.7 43.9,88.1 40.9,88.1 36.1,83.3 26,83.3 25.95,83.35 IC10.17
DB'7  (via drill 0.3)  (1 unrouted)
  Top 0.2: v44.8,83.8 v44.8,88.6 | v52.3,32.1 v52.3,60.2
  Bottom 0.2: IC21.19 54.75,29.65 v52.3,32.1 | 54.85,84.6 55.6,84.6 58.2,82 58.2,80.9 59.5,79.6 59.5,67.4 v52.3,60.2 | IC12.3 54.04,84.54 53.3,83.8 v44.8,83.8 | IC10.18 25.81,85.89 25.9,85.8 27.4,85.8 28.8,84.4 31.4,84.4 32.6,85.6 37.5,85.6 40.5,88.6 v44.8,88.6
GND  (via drill 0.5)
  other vias: 21,64 21,60 35,66 35,59 35,50 40,63 40,59 40,50 40,70 43,67 50,65 50,70 53,70 53,65 63,72 61,69 65,68 61,63 81,63 89,66 82,74 127,81 127,90 124,70 124,75 123,64 142,76 117,90 124,36 108,33 96,24 81,31 82,36 72,43 90,9 109,9 128.2,19 45,15 39,15 34,19 10,4 21,40 75,47
  pour Bottom (isolate 0.2, rank 6): 0,100 160,100 160,0 0,0
  pour Top (isolate 0.2): 0,100 160,100 160,0 0,0
N$1  (via drill 0.3)
  Top 0.2: v52.7,90.2 v52.7,82.7
  Bottom 0.2: IC11.9 IC11.10 42.74,79.13 R1.1 49.13,79.13 v52.7,82.7 | IC24.9 140.23,55 141.4,55 142.1,55.7 142.1,58.3 141.6,58.8 138.9,58.8 138.2,59.5 138.2,71.1 137.4,71.9 137.4,76.9 | 137.4,76.9 137.4,77.2 135.6,79 135.6,89 132.1,92.5 55,92.5 v52.7,90.2 | IC15.9 137.42,76.92 137.4,76.9
N$2
  Bottom 0.2: IC11.11 45.17,82 R1.2 45.54,81.71 XTAL.1
N$3  (via drill 0.3)
  Top 0.2: XTAL.2 50.7,78.1 v50.7,90.1
  Bottom 0.2: IC16.4 144.98,77 144.1,77 142.8,78.3 142.8,81.9 141.4,83.3 138.1,83.3 136.5,84.9 136.5,89.6 132.6,93.5 54.1,93.5 v50.7,90.1 | IC11.8 45.38,74.38 47.9,76.9 49.49,76.9 XTAL.2
N$4  (1 unrouted)
  Bottom 0.2: IC14.23 87.17,88.27 86.6,87.7 79.9,87.7 79.5,88.1 72.7,88.1 70.6,86 67.3,86 66.1,87.1 62.43,87.1
N$5
  Bottom 0.2: IC12.12 64.56,84.54 65.6,83.5 70.7,83.5 72.7,85.5 95.3,85.5 97.4,87.6 97.4,89.55 IC14.19
N$6
  Bottom 0.2: IC12.11 63.9,82 65.2,80.7 70.2,80.7 72.5,83 83.3,83 89.7,76.6 90.9,76.6 92.2,75.3 92.2,74.43 IC14.4
N$7
  Bottom 0.2: IC12.10 63.14,79.46 64.6,78 71.6,78 74.1,80.5 83,80.5 87.1,76.4 87.1,74.45 IC14.2
N$8
  Bottom 0.2: IC13.13 78.82,87.08 79.8,87.1 89,87.1 89.7,87.8 IC14.22
N$9
  Bottom 0.2: IC13.12 83.16,84.54 90.1,77.6 92.5,77.6 94.7,75.4 94.7,74.47 IC14.5
N$10
  Bottom 0.2: IC13.11 82.9,82 89.7,75.2 IC14.3
N$11
  Bottom 0.2: IC13.10 81.94,79.46 84.6,76.8 84.6,74.41 IC14.1
N$12
  Bottom 0.2: IC14.17 102.41,89.09 107.5,84 126.6,84 131.1,79.5 131.55,79.5 IC15.5
N$13  (via drill 0.3)
  Top 0.2: v98.4,16.1 98.4,52.3 99.6,53.5 100.37,53.5 IC42.10
  Bottom 0.2: IC11.2 35.78,87.08 37.4,88.7 37.4,90.4 35.1,92.7 5.2,92.7 2.3,89.8 2.3,53.9 1.4,53 1.4,10.2 3.1,8.5 13.6,8.5 17.1,5 35.5,5 40.2,9.7 57.3,9.7 58.6,11 80.3,11 85.4,16.1 v98.4,16.1
N$14
  Bottom 0.2: IC42.8 100.43,48.4 101.5,48.4 103.1,46.8 114.3,46.8 116,45.1 123.9,45.1 125.9,43.1 129.9,43.1 131.2,44.4 131.2,47.8 128.4,50.6 128.4,58.9 127.7,59.6 124.5,59.6 120.5,63.6 118.81,63.6 IC43.1
N$15  (via drill 0.3)
  Top 0.2: v115.8,43 115.8,59.7 117.2,61.1 118.77,61.1 IC43.2
  Bottom 0.2: IC21.27 60.73,49.97 65.3,45.4 101.7,45.4 102.1,45 113.2,45 115.2,43 v115.8,43
N$16
  Bottom 0.2: IC14.16 104.95,88.35 108.3,85 128.1,85 131.1,82 IC15.4
N$17
  Bottom 0.2: IC14.15 107.49,88.21 109.6,86.1 129.5,86.1 131,84.6 131.53,84.6 IC15.3
N$18
  Bottom 0.2: C1.- 143.57,43 VIDEO.1 148.9,43 154.2,37.7 154.2,22.7 144.9,13.4 J1.2
N$19
  Bottom 0.2: IC14.14 110.03,88.47 111.4,87.1 131.57,87.1 IC15.2
N$20
  Bottom 0.2: IC52.8 114.22,48.38 116.6,46 124.3,46 126.3,44 129.4,44 130.3,44.9 130.3,47.4 128.3,49.4 124.6,49.4 120.6,53.4 118.85,53.4 IC43.5
N$21
  Bottom 0.2: IC24.5 132.65,57.5 134.2,57.5 136.4,59.7 136.4,70 135.6,70.8 135.6,76.2 133.8,78 133.8,87.8 133.2,88.4 113,88.4 112.6,88.8 112.6,89.59 IC14.13
N$22
  Bottom 0.2: IC14.11 110.03,75.93 110.9,76.8 124.7,76.8 129.6,71.9 129.6,62.3 131.8,60.1 IC24.4
N$23
  Bottom 0.2: IC14.10 107.49,75.69 109.5,77.7 125.1,77.7 130.5,72.3 130.5,64 131.8,62.7 132.53,62.7 IC24.3
N$24
  Bottom 0.2: IC14.9 104.95,76.85 107.1,79 126.8,79 130.1,75.7 133.1,75.7 133.8,75 133.8,70 134.6,69.2 134.6,66.4 133.4,65.2 132.61,65.2 IC24.2
N$25
  Bottom 0.2: IC15.1 131.81,89.6 133.5,89.6 134.7,88.4 134.7,78.5 136.5,76.7 136.5,71.4 137.3,70.6 137.3,58.8 138.5,57.6 140.17,57.6 IC24.10
N$26  (via drill 0.3)
  Top 0.2: v62.6,21.3 62.6,33.9 63.5,34.8 IC22.3
  Bottom 0.2: IC40.6 29.41,22.59 31,21 60.7,21 61,21.3 v62.6,21.3
N$27
  Bottom 0.2: IC11.12 42.55,84.6 52.3,84.6 53.3,85.6 56.1,85.6 59.2,82.5 59.2,81.3 60.4,80.1 60.4,75.4 61.42,74.38 IC12.8 64.48,74.38 65.5,75.4 73.4,75.4 74.4,74.4 76.39,74.4 IC13.8 76.43,74.4 76.5,74.4 78.8,72.1 97.7,72.1 98.6,73 98.6,75.6 102.5,79.5 127,79.5 129.58,76.92 IC15.6 131.61,76.9 133.5,76.9 134.7,75.7 134.7,70.4 135.5,69.6 135.5,60.2 134.1,58.8 131.1,58.8 130.5,58.2 130.5,56.3 131.8,55 132.57,55 IC24.6
N$28
  Bottom 0.2: D1.A 143.32,36.96 R2.1 139.48,44.45 C1.+ 139.53,46.43 142,48.9 R3.1
N$29
  Top 0.2: IC52.13 114.98,61.08 115.9,62 115.9,70.3 123.6,78 136.1,78 137.5,79.4 139.35,79.4 IC15.10
N$30  (via drill 0.3)
  Top 0.2: IC16.15 151.5,82 149.7,80.2 149.7,58.3 151.5,56.5 v151.5,29.1
  Bottom 0.2: v151.5,29.1 145.12,29.1 | 145.12,29.1 RN1.5 | 145.12,29.1 141.4,29.1 SW1.4
N$31
  Bottom 0.2: D2.A 135.21,47.61 R3.2
N$32
  Bottom 0.2: IC43.6 120.28,50.92 124.3,46.9 125.7,46.9 127.1,45.5 D2.C
N$33  (via drill 0.3)
  Top 0.2: v61.6,20.5 61.6,35.6 63.3,37.3 64.74,37.3 IC22.2
  Bottom 0.2: IC40.3 21.79,22.91 24.2,20.5 v61.6,20.5
N$34  (via drill 0.3)
  Top 0.2: v67.9,62.1 67.9,27.8 67.3,27.2 IC22.6
  Bottom 0.2: IC33.1 75.62,63.62 74.1,62.1 v67.9,62.1 | IC22.6 64.08,27.2 64,27.2 60.3,30.9 56,30.9 50.9,36 42.6,36 39.3,32.7 33.2,32.7 31.95,31.45 IC40.10
N$35  (via drill 0.3)
  Top 0.2: IC22.7 64.84,24.7 67.9,24.7 68.7,25.5 v68.7,60.1
  Bottom 0.2: IC33.2 76.28,61.08 75.3,60.1 v68.7,60.1 | IC40.13 24.33,30.17 26.6,27.9 37.2,27.9 42.5,33.2 48.3,33.2 53.2,28.4 60.2,28.4 63.9,24.7 64.74,24.7 IC22.7
N$36
  Bottom 0.2: IC22.12 IC32.5
N$37  (1 unrouted)
  Top 0.2: C5.2 89.7,35 90.5,35.8 90.5,57.7 91.3,58.5 92.75,58.5 IC42.3
  Bottom 0.2: IC41.5 92.01,29.73 C5.2 89.7,32 86.9,34.8 IC32.14
N$38
  Top 0.2: IC33.4 76.5,56 | 76.5,56 74,58.5 72.45,58.5 IC23.12 | IC32.6 77.41,27.19 76.5,28.1 76.5,56
  Bottom 0.2: IC42.1 92.49,63.61 92.5,63.6 89.9,63.6 88.4,62.1 83.9,62.1 81,59.2 81,56.5 80.5,56 IC33.4
N$39  (via drill 0.3)
  Top 0.2: v89.7,39.1 89.7,59.4 91.4,61.1 92.77,61.1 IC42.2
  Bottom 0.2: IC30.3 21.79,37.01 24.3,34.5 38.3,34.5 42.4,38.6 67.1,38.6 69.4,36.3 75.1,36.3 76.15,37.35 IC32.2 82.95,37.35 84,38.4 89,38.4 v89.7,39.1
N$40  (via drill 0.3)  (1 unrouted)
  Top 0.2: v116.1,25.7 116.1,28.7 116.8,29.4 116.8,57.7 117.6,58.5 118.75,58.5 IC43.3 | v32.2,14 30.7,15.5 30.7,33.9 29.4,35.2 IC30.6
  Bottom 0.2: v32.2,14 50.1,14 50.7,14.6 79.2,14.6 82.7,18.1 82.7,28.3 | 82.7,28.3 82.7,32.5 80.4,34.8 IC32.3 | v116.1,25.7 110.3,25.7 107.7,28.3 82.7,28.3
N$41
  Bottom 0.2: IC43.4 116.1,56 115.1,57 104.2,57 101.7,59.5 84.4,59.5 82.3,57.4 82.3,54.7 81,53.4 78.85,53.4 IC33.5
N$42
  Bottom 0.2: IC23.9 73.72,50.92 74.6,51.8 74.6,56.4 73.5,57.5 69.2,57.5 65.7,61 64.87,61 IC23.2
N$43
  Bottom 0.2: IC51.5 IC41.12
N$44  (via drill 0.3)  (1 unrouted)
  Top 0.2: v122.1,36.3 122.1,55.8 124.8,58.5 126.37,58.5 IC43.12
  Bottom 0.2: IC41.14 103,34.8 104,35.8 110,35.8 111,34.8 IC51.14 115.71,34.81 117.2,36.3 v122.1,36.3
N$45
  Bottom 0.2: IC33.8 88.02,48.38 90,46.4 102.1,46.4 102.6,45.9 113.7,45.9 115.4,44.2 123.5,44.2 125.5,42.2 130.4,42.2 130.5,42.3 | IC43.13 127.82,61.08 129.3,59.6 129.3,51 132.1,48.2 132.1,43.9 130.5,42.3 | IC53.13 126.45,37.35 126.5,37.4 132.36,37.4 C6.2 132.76,40.04 130.5,42.3
N$46  (via drill 0.3)
  Top 0.2: IC33.10 84.84,53.46 84,52.6 v84,25.9
  Bottom 0.2: IC41.7 89.65,24.65 88.4,25.9 v84,25.9 | IC33.10 86.45,53.5 89.8,53.5 90.7,54.4 121.3,54.4 124.8,50.9 126.39,50.9 IC43.9
N$47
  Bottom 0.2: IC33.9 IC42.6 97.82,50.92 99.3,52.4 103.1,52.4 104.2,53.5 105.75,53.5 IC52.5
N$48
  Bottom 0.2: IC51.12 115.43,29.73 117,31.3 122.9,31.3 123.8,32.2 126.34,32.2 IC53.11
N$49  (via drill 0.3)
  Top 0.2: v40.6,9 v40.6,46.6 | v94.8,15.4 v94.8,33.6 94.8,52.36 93.7,53.46 IC42.5
  Bottom 0.2: IC51.3 103.89,34.81 102.88,33.8 95,33.8 v94.8,33.6 | IC30.10 31.95,45.65 32.9,46.6 v40.6,46.6 | v40.6,9 57.8,9 58.9,10.1 80.2,10.1 85.5,15.4 v94.8,15.4
N$50
  Top 0.2: IC16.1 146.16,84.54 148.8,81.9 148.8,57.5 150.7,55.6 150.7,28.6 148.7,26.6 145.16,26.6 RN1.4
  Bottom 0.2: RN1.4 141.38,26.54 SW1.3
N$51  (via drill 0.3)
  Top 0.2: v123.6,38.8 123.6,54.5 125.1,56 IC43.11 | IC33.12 84.54,58.54 82.8,56.8 v82.8,38.9
  Bottom 0.2: v123.6,38.8 111.6,38.8 110.15,37.35 IC51.2 104.65,37.35 103.6,38.4 98.1,38.4 95.3,41.2 90.1,41.2 87.8,38.9 v82.8,38.9 68.7,38.9 64,43.6 41.6,43.6 40.6,42.6 31.2,42.6 30.3,41.7 27.1,41.7 24.33,44.47 IC30.13
N$52  (via drill 0.3)
  Top 0.2: v95.8,30.8 95.8,54.5 94.3,56 IC42.4
  Bottom 0.2: IC53.9 124.4,27.2 123.3,28.3 110.3,28.3 107.8,30.8 v95.8,30.8
N$53
  Bottom 0.2: IC51.6 107.2,27.2 107.9,26.5 107.9,24 107.2,23.3 104.3,23.3 103.7,22.7 103.7,20.8 100.8,17.9 85.1,17.9 80,12.8 51.4,12.8 51,12.4 26.1,12.4 24.4,10.7 24.4,9.26 IC1.4
N$54
  Bottom 0.2: IC51.7 105.74,24.6 104.2,24.6 102.7,23.1 102.7,21 100.5,18.8 84.7,18.8 79.6,13.7 50.9,13.7 50.5,13.3 30.7,13.3 29.4,14.6 29.4,16.7 IC1.9
N$55  (via drill 0.3)
  Top 0.2: IC52.6 104.68,50.92 103.6,52 v103.6,61
  Bottom 0.2: v103.6,61 100.49,61 IC42.13
N$56
  Bottom 0.2: IC43.10 124.54,53.46 121,56.9 121,58.6 120,59.6 112.2,59.6 108.2,63.6 105.81,63.6 IC52.1
N$57
  Bottom 0.2: IC42.12 99.96,58.54 99.9,58.5 96,58.5 94.5,57 90.6,57 88.6,55 85.2,55 81.2,51 78.87,51 IC33.6
N$58
  Top 0.2: IC16.10 151.9,69.3 150.8,68.2 150.8,58.6 152.5,56.9 152.5,26.5 150,24 RN1.3
  Bottom 0.2: RN1.3 141.38,24 SW1.2
N$59
  Top 0.2: RN1.2 145.14,21.5 149.5,21.5 153.1,25.1 153.1,57.6 151.5,59.2 151.5,66.2 152.1,66.8 152.64,66.8 IC16.9
  Bottom 0.2: RN1.2 141.38,21.46 SW1.1
N$60
  Top 0.2: R4.2 57.3,33.7 58.3,34.7 59.19,34.7 IC21.21
R1  (via drill 0.3)
  Top 0.2: v102.4,36.3 IC14.8
  Bottom 0.2: IC41.3 94.31,34.81 95.8,36.3 v102.4,36.3 | IC14.8
R2  (via drill 0.3)
  Top 0.2: v88.9,37.3 88.9,60.08 87.9,61.08 IC33.13 | v98.3,62.4 98.3,70.9 99.8,72.4 99.8,74.31 IC14.7
  Bottom 0.2: IC33.13 88.88,61.08 90.2,62.4 v98.3,62.4 | v88.9,37.3 92.64,37.3 IC41.2
R4  (via drill 0.3)
  Top 0.2: v96.5,27.2 v96.5,57.5 97.3,58.3 97.3,74.35 IC14.6
  Bottom 0.2: IC52.4 103.6,56 102.1,57.5 v96.5,57.5 | 96.5,27.1 v96.5,27.2 96.19,27.19 IC41.6
SYNC  (via drill 0.3)
  Top 0.2: v97.6,14.9 97.6,54.7 98.9,56 IC42.11
  Bottom 0.2: D1.C 133.8,35 130.9,32.1 130.9,25.4 123.9,18.4 105.3,18.4 101.8,14.9 v97.6,14.9
T  (via drill 0.3)
  Top 0.2: IC22.5 66.73,29.73 67,30 67,57.1 65.5,58.6 | v60.3,87.4 60.3,72 61.7,70.6 v67.1,70.6 67.1,60.2 65.5,58.6 | v140.6,72.1 v127.7,72.1 | 64.73,58.6 IC23.3 64.85,58.6 65.5,58.6
  Bottom 0.2: IC11.13 51.48,87.08 52.5,88.1 59.6,88.1 v60.3,87.4 | IC16.13 151.32,76.92 150.5,76.1 150.5,71.8 | 150.5,71.8 152.64,71.8 IC16.11 | IC23.11 68.9,56 66.4,58.5 64.83,58.5 IC23.3 | 150.5,71.8 148.4,71.8 147.2,73 141.5,73 v140.6,72.1 | v127.7,72.1 120.3,72.1 118.8,70.6 v67.1,70.6
ZR
  Bottom 0.2: IC52.9 112.12,50.92 110.6,49.4 69,49.5 67.6,50.9 64.81,50.9 IC23.6

### Text on the board
tPlace: KRAMER MC BS1K | v1.0 | 100n | 100n | 100n | 100n | 470p | 510 | 2716 | LS95 | LS95 | LS95 | LS04 | CHAR / ROM | LS193 | LS245 | 100n | 100n | 100n | LS95 | 100n | 100µ | LS74 | LS20 | LS08 | LS20 | LS04 | 47 | 100n | 6264 | 100n | 100n | 1N4148 | 1µ | LS157 | 270 | 1N4148 | LS74 | LS193 | LS193 | LS193 | LS193 | LS157 | 470p | 1 2 3 4 / 0 1 0 1 / 0 1 1 0 / 0 1 1 1 | 1k | LS51 | VIDEO / RAM | VIDEO / intern | XTAL / 9 MHz / 10.5MHz / 12 MHz | A10 PD / 1k | 100n | redesign 2022 by [ferryTALE] | JLCJLCJLCJLC